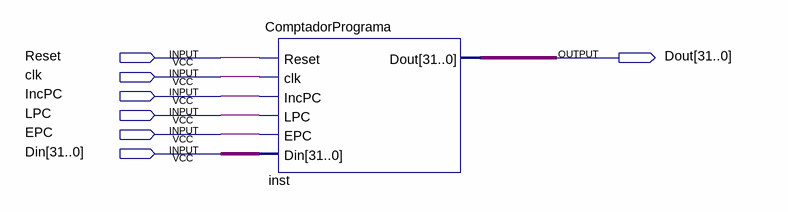
[diagram p0: schematic sheet]
// Quartus schematic Comptador_Programa.bdf as structural Verilog: 1 symbols, 7 pins
module Comptador_Programa (
  input  Reset,
  input  clk,
  input  IncPC,
  input  LPC,
  input  EPC,
  input  [31:0] Din,
  output [31:0] Dout
);

  ComptadorPrograma inst (.Reset(Reset), .clk(clk), .IncPC(IncPC), .LPC(LPC), .EPC(EPC), .Din(Din), .Dout(Dout));
endmodule
